# EAGLE design aery32_display_cloud (EAGLE 6.4)
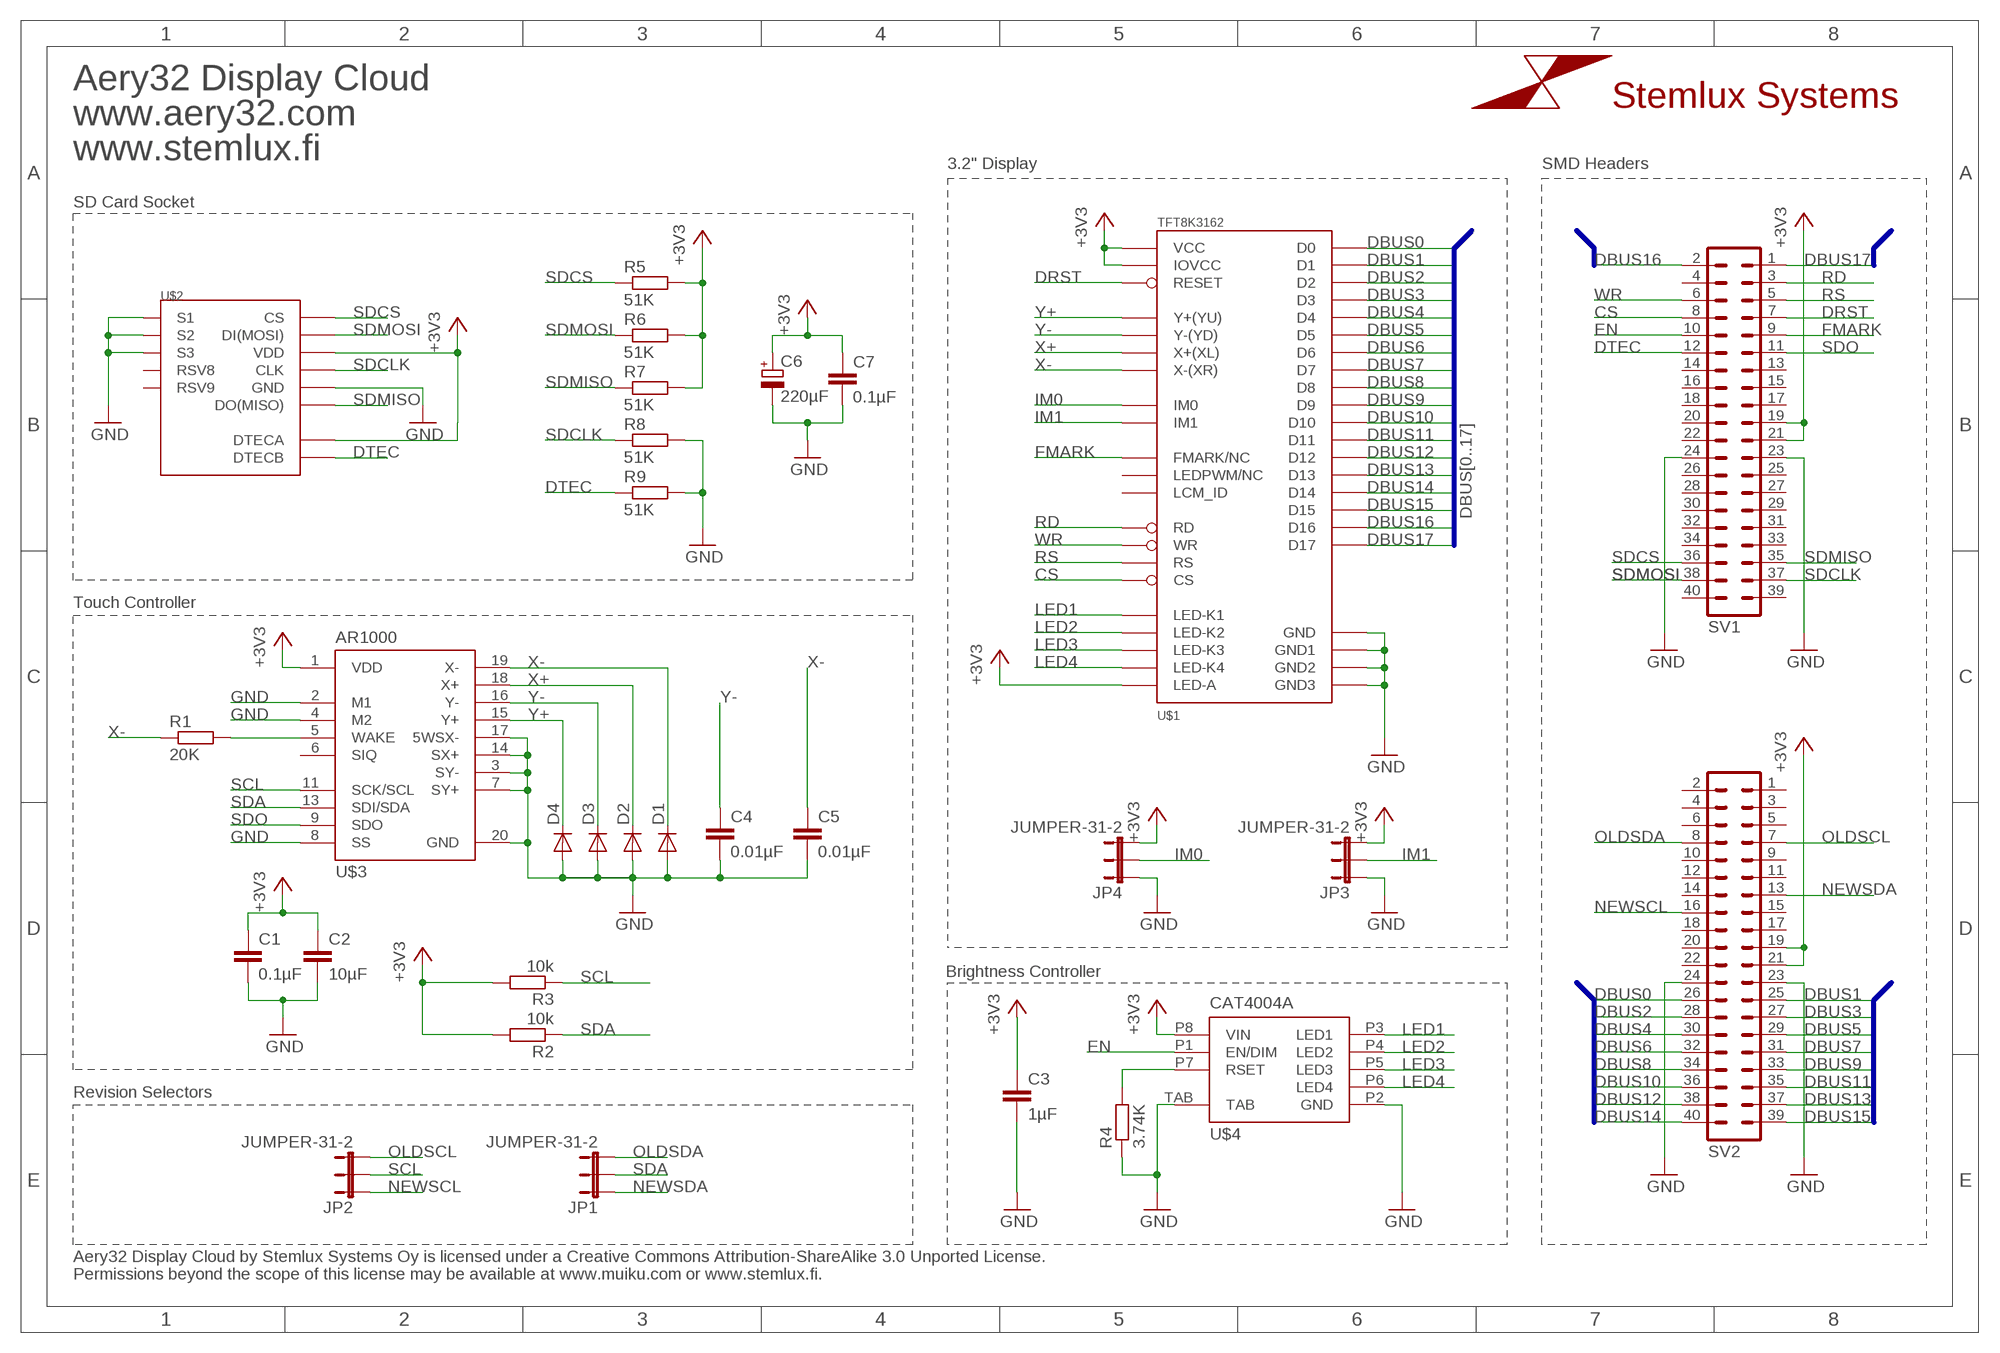
[diagram p0: schematic, sheet 1]

## Parts
C1  0.1µF  C-EUC0402  [C0402]
C2  10µF  C-EUC0805  [C0805]
C3  1µF  C-EUC0402  [C0402]
C4  0.01µF  C-EUC0402  [C0402]
C5  0.01µF  C-EUC0402  [C0402]
C6  220µF  CPOL-EUSMCB  [SMC_B]
C7  0.1µF  C-EUC0402  [C0402]
D1  DIODESOD  [SOD-323]
D2  DIODESOD  [SOD-323]
D3  DIODESOD  [SOD-323]
D4  DIODESOD  [SOD-323]
JP1  JUMPER-31-2  [SJ_3_PASTE1&2]
JP2  JUMPER-31-2  [SJ_3_PASTE1&2]
JP3  JUMPER-31-2  [SJ_3_PASTE1&2]
JP4  JUMPER-31-2  [SJ_3_PASTE1&2]
R1  20K  R-EU_R0402  [R0402]
R2  10k  R-EU_R0402  [R0402]
R3  10k  R-EU_R0402  [R0402]
R4  3.74K  R-EU_R0402  [R0402]
R5  51K  R-EU_R0402  [R0402]
R6  51K  R-EU_R0402  [R0402]
R7  51K  R-EU_R0402  [R0402]
R8  51K  R-EU_R0402  [R0402]
R9  51K  R-EU_R0402  [R0402]
SV1  MA20-2PEG  [MA20-2_SMD]
SV2  MA20-2PEG  [MA20-2_SMD]
U$1  TFT8K3162  [TFT8K3162]
U$2  MICROSD_SOCKETBT  [DM3BT_PUSH-PUSH_USD_SOCKET]
U$3  AR1000  [SSOP20]
U$4  CAT4004A  [UDFN-8,2X2]
U$7  LOGOSS  [LOGO_SILK_SMALL]

## Nets
+3V3: C1.1 C2.1 C3.1 C6.+ C7.1 JP3.3 JP4.3 R2.2 R3.2 R5.2 R6.2 R7.2 SV1.19 SV1.21 SV2.19 SV2.21 U$1.P$36(IOVCC) U$1.P$37(VCC) U$1.P$43(LED-A) U$2.#4(VDD)(VDD) U$2.DETECTA(DTECA) U$3.1(VDD) U$4.P8(VIN)
CS: SV1.8 U$1.P$34(CS)
DBUS0: SV2.26 U$1.P$30(D0)
DBUS1: SV2.25 U$1.P$29(D1)
DBUS2: SV2.28 U$1.P$28(D2)
DBUS3: SV2.27 U$1.P$27(D3)
DBUS4: SV2.30 U$1.P$26(D4)
DBUS5: SV2.29 U$1.P$25(D5)
DBUS6: SV2.32 U$1.P$24(D6)
DBUS7: SV2.31 U$1.P$23(D7)
DBUS8: SV2.34 U$1.P$22(D8)
DBUS9: SV2.33 U$1.P$21(D9)
DBUS10: SV2.36 U$1.P$20(D10)
DBUS11: SV2.35 U$1.P$19(D11)
DBUS12: SV2.38 U$1.P$18(D12)
DBUS13: SV2.37 U$1.P$17(D13)
DBUS14: SV2.40 U$1.P$16(D14)
DBUS15: SV2.39 U$1.P$15(D15)
DBUS16: SV1.2 U$1.P$14(D16)
DBUS17: SV1.1 U$1.P$13(D17)
DRST: SV1.7 U$1.P$12(RESET)
DTEC: R9.1 SV1.12 U$2.DETECTB(DTECB)
EN: SV1.10 U$4.P1(EN/DIM)
FMARK: SV1.9 U$1.P$9(FMARK/NC)
GND: C1.2 C2.2 C3.2 C4.2 C5.2 C6.- C7.2 D1.2(A) D2.2(A) D3.2(A) D4.2(A) JP3.1 JP4.1 R4.1 R8.2 R9.2 SV1.23 SV1.24 SV2.23 SV2.24 U$1.P$1(GND) U$1.P$6(GND1) U$1.P$35(GND2) U$1.P$44(GND3) U$2.#6(VSS)(GND) U$2.SHIELD1(S1) U$2.SHIELD2(S2) U$2.SHIELD3(S3) U$3.2(M1) U$3.3(SY-) U$3.4(M2) U$3.7(SY+) U$3.8(SS) U$3.14(SX+) U$3.17(5WSX-) U$3.20(GND) U$4.P2(GND) U$4.TAB
IM0: JP4.2 U$1.P$7(IM0)
IM1: JP3.2 U$1.P$8(IM1)
LED1: U$1.P$42(LED-K1) U$4.P3(LED1)
LED2: U$1.P$41(LED-K2) U$4.P4(LED2)
LED3: U$1.P$40(LED-K3) U$4.P5(LED3)
LED4: U$1.P$39(LED-K4) U$4.P6(LED4)
N$2: R4.2 U$4.P7(RSET)
N$4: R1.2 U$3.5(WAKE)
NEWSCL: JP2.1 SV2.16
NEWSDA: JP1.1 SV2.13
OLDSCL: JP2.3 SV2.7
OLDSDA: JP1.3 SV2.8
RD: SV1.3 U$1.P$31(RD)
RS: SV1.5 U$1.P$33(RS)
SCL: JP2.2 R3.1 U$3.11(SCK/SCL)
SDA: JP1.2 R2.1 U$3.13(SDI/SDA)
SDCLK: R8.1 SV1.37 U$2.#5(CLK)(CLK)
SDCS: R5.1 SV1.36 U$2.#1(DAT3_OR_CS)(CS)
SDMISO: R7.1 SV1.35 U$2.#7(DAT0_OR_DO)(DO(MISO))
SDMOSI: R6.1 SV1.38 U$2.2#(CMD_OR_DI)(DI(MOSI))
SDO: SV1.11 U$3.9(SDO)
WR: SV1.6 U$1.P$32(WR)
X+: D2.1(C) U$1.P$3(X+(XL)) U$3.18(X+)
X-: C5.1 D1.1(C) R1.1 U$1.P$5(X-(XR)) U$3.19(X-)
Y+: D4.1(C) U$1.P$2(Y+(YU)) U$3.15(Y+)
Y-: C4.1 D3.1(C) U$1.P$4(Y-(YD)) U$3.16(Y-)
Unconnected: SV1.4 SV1.13 SV1.14 SV1.15 SV1.16 SV1.17 SV1.18 SV1.20 SV1.22 SV1.25 SV1.26 SV1.27 SV1.28 SV1.29 SV1.30 SV1.31 SV1.32 SV1.33 SV1.34 SV1.39 SV1.40 SV2.1 SV2.2 SV2.3 SV2.4 SV2.5 SV2.6 SV2.9 SV2.10 SV2.11 SV2.12 SV2.14 SV2.15 SV2.17 SV2.18 SV2.20 SV2.22 U$1.P$10(LEDPWM/NC) U$1.P$11(LCM_ID) U$2.#8(DAT1_OR_NC)(RSV8) U$2.#9(DAT2_OR_NC)(RSV9) U$3.6(SIQ)

## Buses
DBUS[0..17]
DBUS[0..16]
DBUS[0..15]
DBUS[17]
DBUS[16]

## Notes on the sheet
- Aery32 Display Cloud
- www.aery32.com
- www.stemlux.fi
- 3.2" Display | SMD Headers
- SD Card Socket
- Touch Controller
- Brightness Controller
- Revision Selectors
- Aery32 Display Cloud by Stemlux Systems Oy is licensed under a Creative Commons Attribution-ShareAlike 3.0 Unported License.
- Permissions beyond the scope of this license may be available at www.muiku.com or www.stemlux.fi.

## Library data of the parts
C1-C5 C7 = resistor:C-EU: CAPACITOR, European symbol
C6 = resistor:CPOL-EU: POLARIZED CAPACITOR, European symbol
D1-D4 = SparkFun-DiscreteSemi:DIODE: Diode These are standard reverse protection diodes and small signal diodes. SMA package can handle up to about 1A. SOD-323 can handle about 200mA. What the SOD-323 package when ordering, there are some mfgs out there that are 5-pin packages.
JP1-JP4 = SparkFun-Passives:JUMPER-3
R1-R9 = resistor:R-EU_: RESISTOR, European symbol
SV1 SV2 = aery32:MA20-2: PIN HEADER
U$1 = Stemlux Systems:TFT8K3162
U$2 = Stemlux Systems:MICROSD_SOCKET
U$3 = Stemlux Systems:AR1000
U$4 = Stemlux Systems:CAT4004A
U$7 = Stemlux Systems:LOGO

## Board
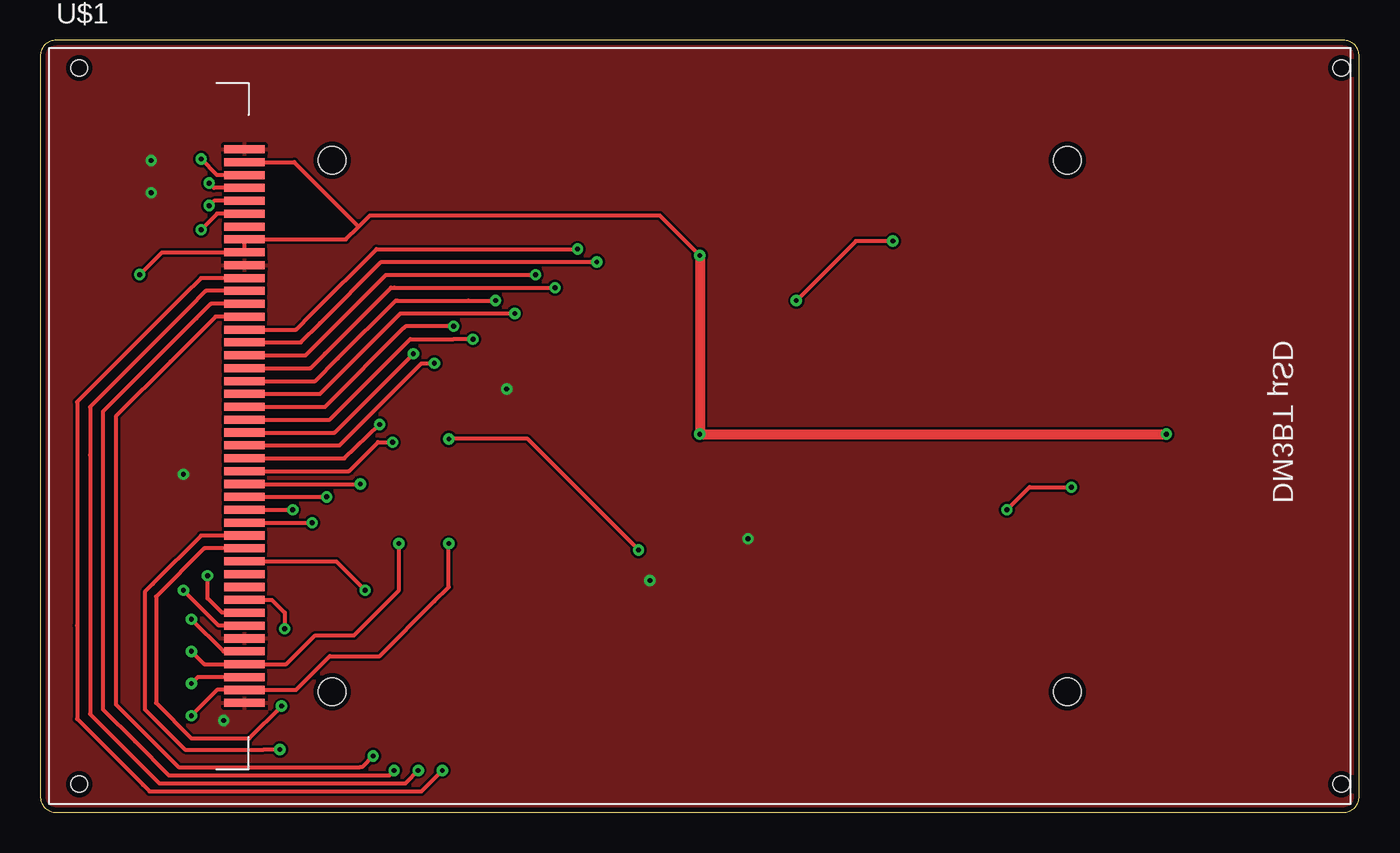
[diagram p1: board, top side]
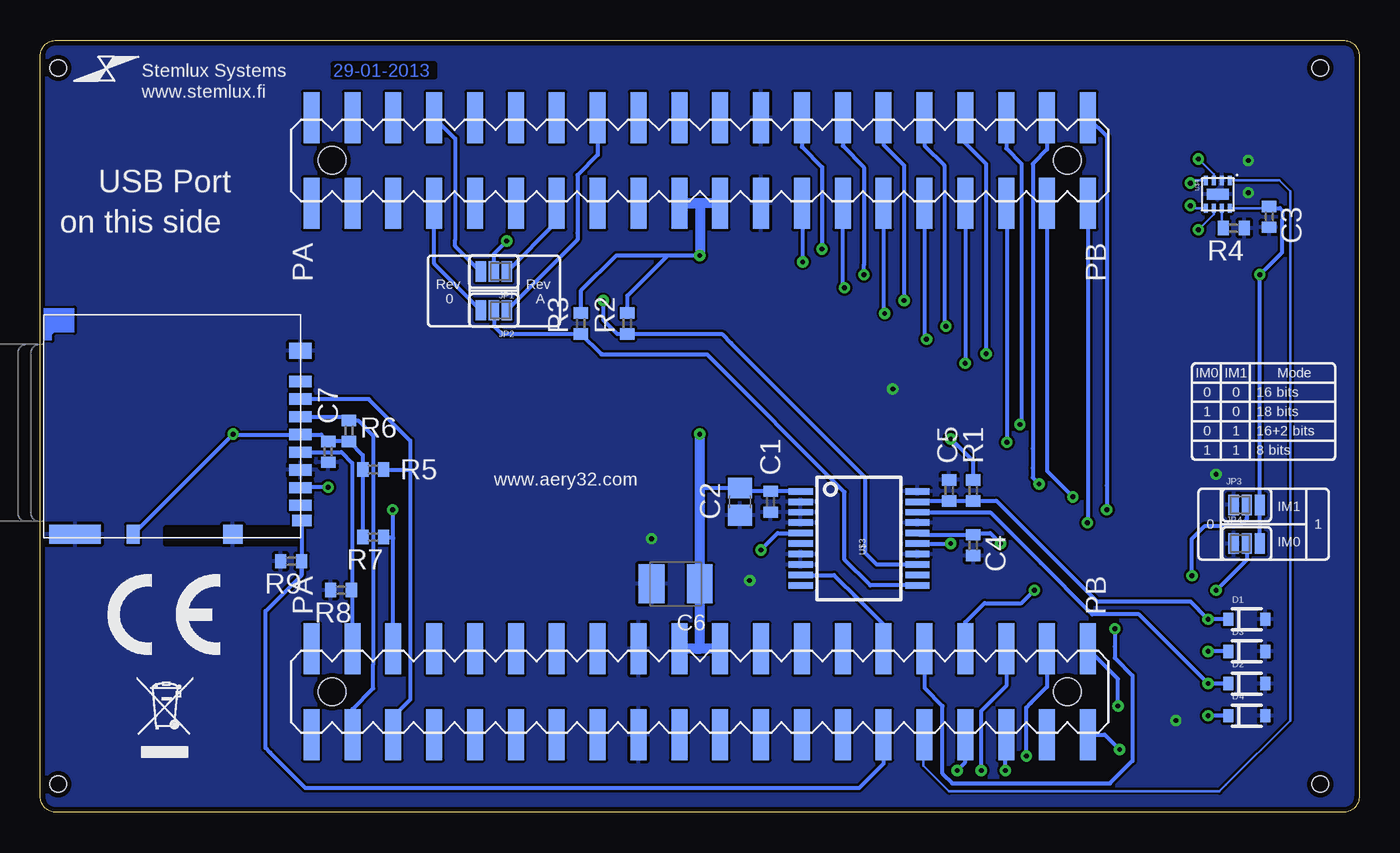
[diagram p2: board, bottom side, seen from below]

Size 82 x 47.98 mm. Coordinates in mm from the lower left corner, seen from the top.
Outline: 0,46.98 0,1 arc90 1,0 81,0 arc90 82,1 82,46.98 arc90 81,47.98 1,47.98 arc90 0,46.98
Copper layers (1*16): Top 0.018mm / dielectric 1.55mm / Bottom 0.018mm
Design rules "default *": minimum track width 0.15mm, minimum drill 0.25mm, track to track 0.15mm, track to pad 0.15mm, pad to pad 0.15mm, via to via 0.15mm, smd to smd 0.15mm, copper to edge 0.3mm, drill to drill 0.3mm, minimum pad ring 0.2mm, minimum via ring 0.2mm, stop-mask expansion 0.5mm, vias tented up to drill 0.3mm, thermal gap 0.2mm

### Footprints (pad centres in the part's own frame; a part is rotated, then mirrored left to right if it is on the bottom)
C0402 = smd 0.7 x 0.9: 1 -0.65,0; 2 0.65,0
C0805 = smd 1.3 x 1.5: 1 -0.85,0; 2 0.85,0
SMC_B = smd 1.6 x 2.4: + -1.5,0; - 1.5,0
SOD-323 = smd 0.63 x 0.83: 1 -1.15,0; 2 1.15,0
SJ_3_PASTE1&2 = smd 0.635 x 1.27: 1 -0.813,0; 2 0,0; 3 0.813,0
R0402 = smd 0.7 x 0.9: 1 -0.65,0; 2 0.65,0
MA20-2_SMD = smd 1 x 3.17: 1 -24.13,-2.665; 2 -24.13,2.665; 3 -21.59,-2.665; 4 -21.59,2.665; 5 -19.05,-2.665; 6 -19.05,2.665; 7 -16.51,-2.665; 8 -16.51,2.665; 9 -13.97,-2.665; 10 -13.97,2.665; 11 -11.43,-2.665; 12 -11.43,2.665; 13 -8.89,-2.665; 14 -8.89,2.665; 15 -6.35,-2.665; 16 -6.35,2.665; 17 -3.81,-2.665; 18 -3.81,2.665; 19 -1.27,-2.665; 20 -1.27,2.665; 21 1.27,-2.665; 22 1.27,2.665; 23 3.81,-2.665; 24 3.81,2.665; 25 6.35,-2.665; 26 6.35,2.665; 27 8.89,-2.665; 28 8.89,2.665; 29 11.43,-2.665; 30 11.43,2.665; 31 13.97,-2.665; 32 13.97,2.665; 33 16.51,-2.665; 34 16.51,2.665; 35 19.05,-2.665; 36 19.05,2.665; 37 21.59,-2.665; 38 21.59,2.665; 39 24.13,-2.665; 40 24.13,2.665 | hole 1.7: -22.86,0; 22.86,0
TFT8K3162 = smd 2.5 x 0.5 bottom: P$1 28.3,-17.2; P$2 28.3,-16.4; P$3 28.3,-15.6; P$4 28.3,-14.8; P$5 28.3,-14; P$6 28.3,-13.2; P$7 28.3,-12.4; P$8 28.3,-11.6; P$9 28.3,-10.8; P$10 28.3,-10; P$11 28.3,-9.2; P$12 28.3,-8.4; P$13 28.3,-7.6; P$14 28.3,-6.8; P$15 28.3,-6; P$16 28.3,-5.2; P$17 28.3,-4.4; P$18 28.3,-3.6; P$19 28.3,-2.8; P$20 28.3,-2; P$21 28.3,-1.2; P$22 28.3,-0.4; P$23 28.3,0.4; P$24 28.3,1.2; P$25 28.3,2; P$26 28.3,2.8; P$27 28.3,3.6; P$28 28.3,4.4; P$29 28.3,5.2; P$30 28.3,6; P$31 28.3,6.8; P$32 28.3,7.6; P$33 28.3,8.4; P$34 28.3,9.2; P$35 28.3,10; P$36 28.3,10.8; P$37 28.3,11.6; P$38 28.3,12.4; P$39 28.3,13.2; P$40 28.3,14; P$41 28.3,14.8; P$42 28.3,15.6; P$43 28.3,16.4; P$44 28.3,17.2 | hole 1: -39.875,-22.25; -39.875,22.25; 38.575,-22.25; 38.575,22.25
DM3BT_PUSH-PUSH_USD_SOCKET = smd 0.7 x 1.4: 2#(CMD_OR_DI) -0.575,7.975; #1(DAT3_OR_CS) -1.675,7.975; #4(VDD) 0.525,7.975; #5(CLK) 1.625,7.975; #6(VSS) 2.725,7.975; #7(DAT0_OR_DO) 3.825,7.975; #8(DAT1_OR_NC) 4.925,7.975; #9(DAT2_OR_NC) -2.775,7.975 | smd 1.2 x 0.8: DETECTA 6.725,-2.425 | smd 0.7 x 1.2: DETECTB 5.875,8.075 | smd 1 x 1.4: SHIELD1 -4.675,7.975 | smd 1.2 x 1.2: SHIELD2 6.725,3.775 | smd 1.2 x 3.2: SHIELD3 6.725,-6.025
SSOP20 = smd 0.4 x 1.5: 1 -2.925,-3.625; 2 -2.275,-3.625; 3 -1.625,-3.625; 4 -0.975,-3.625; 5 -0.325,-3.625; 6 0.325,-3.625; 7 0.975,-3.625; 8 1.625,-3.625; 9 2.275,-3.625; 10 2.925,-3.625; 11 2.925,3.625; 12 2.275,3.625; 13 1.625,3.625; 14 0.975,3.625; 15 0.325,3.625; 16 -0.325,3.625; 17 -0.975,3.625; 18 -1.625,3.625; 19 -2.275,3.625; 20 -2.925,3.625
UDFN-8,2X2 = smd 0.575 x 0.25: P1 -0.863,0.75; P2 -0.863,0.25; P3 -0.863,-0.25; P4 -0.863,-0.75; P5 0.863,-0.75; P6 0.863,-0.25; P7 0.863,0.25; P8 0.863,0.75 | smd 0.7 x 1.35: TAB 0,0

### Placement (x,y rotation side)
C1  36.6,19.3 270 bottom
C2  38.5,19.3 270 bottom
C3  5.6,37 270 bottom
C4  24,16.6 270 bottom
C5  25.5,20 90 bottom
C6  42.5,14.2 180 bottom
C7  64.1,22.4 270 bottom
D1  7,12 0 bottom
D2  7,8 0 bottom
D3  7,10 0 bottom
D4  7,6 0 bottom
JP1  53.8,33.6 180 bottom
JP2  53.8,31.2 180 bottom
JP3  7,19.1 0 bottom
JP4  7,16.7 0 bottom
R1  24,20 90 bottom
R2  45.5,30.38 90 bottom
R3  48.4,30.38 90 bottom
R4  7.8,36.3 180 bottom
R5  61.3,21.3 180 bottom
R6  62.8,23.7 270 bottom
R7  61.3,17.1 180 bottom
R8  63.3,13.8 180 bottom
R9  66.4,15.6 180 bottom
SV1  41,7.49 180 bottom
SV2  41,40.51 0 bottom
U$1  41,24 0 bottom
U$2  73.8,24 270 bottom
U$3  31.1,17.02 270 bottom
U$4  8.8,38.4 270 bottom
U$5  [CE/5MM]  77.8,9.8 0 bottom
U$6  [WEEE/5MM]  76,3.4 0 bottom
U$7  77.9,46.2 0 bottom

### Tracks (layer width: path | path; a pad name or v marks a point on that pad's centre or on a via)
+3V3  (via drill 0.3)
  Top 0.254: v6.19,33.41 7.57,34.8 9.5,34.8 U$1.P$36 U$1.P$37 16.4,35.6 19,35.6 19.8,36.4 | 19.8,36.4 20.5,37.1 38.5,37.1 v41,34.6 | U$1.P$43 15.8,40.4 19.8,36.4
  Top 0.61: v41,34.6 v41,23.5 v70,23.5
  Bottom 0.15: U$4.P8 5.71,37.54 C3.1
  Bottom 0.254: 61.95,21.5 61.95,22.2 R6.2 C7.1 64.53,23.48 U$2.#4(VDD) 70.03,23.48 v70,23.5 U$2.DETECTA | 61.95,21.5 R5.2 | R5.2 R7.2 | R5.2 61.95,21.5 | U$3.1 36.58,19.95 C1.1 38.28,19.95 C2.1 40.95,20.15 41,20.1 | v41,34.6 43,34.6 | 43,34.6 46.2,34.6 48.4,32.4 48.4,32.3 R3.2 | R2.2 45.5,32.1 43,34.6 | 5.75,37.55 C3.1 | JP4.3 JP3.3 v6.19,33.41 5.7,33.9 4.8,34.8 4.8,36.8 4.8,37.4 4.94,37.54 5.71,37.54
  Bottom 0.61: SV1.19 41.2,10.16 | 41.2,10.16 SV1.21 | SV2.21 SV2.19 41,37.85 v41,34.6 | C6.+ 41,10.16 41.2,10.16 | C6.+ 41,14.3 | 41,14.3 41,20.1 v41,23.5 | C6.+ 41,14.3
CS  (via drill 0.3)
  Top 0.254: U$1.P$34 10.4,33.2 10,33.2 8.9,32.1 2.3,25.5 2.3,11.6 2.3,5.8 6.4,1.7 6.8,1.3 19.9,1.3 23.7,1.3 v25,2.6
  Bottom 0.254: v25,2.6 24.49,3.11 SV1.8
DBUS0  (via drill 0.3)
  Top 0.254: U$1.P$30 15.9,30 16.9,31 20.9,35 v33.4,35
  Bottom 0.254: SV2.26 34.65,41.35 33.4,40.1 v33.4,35
DBUS1  (via drill 0.3)
  Top 0.254: v34.6,34.2 34.3,34.2 21.6,34.2 21.2,34.2 17.4,30.4 16.2,29.2 U$1.P$29
  Bottom 0.254: SV2.25 34.6,37.8 v34.6,34.2
DBUS2  (via drill 0.3)
  Top 0.254: v30.8,33.4 21.8,33.4 21.5,33.4 17.5,29.4 16.5,28.4 U$1.P$28
  Bottom 0.254: SV2.28 32.11,41.41 30.8,40.1 30.8,34 v30.8,33.4
DBUS3  (via drill 0.3)
  Top 0.254: v32,32.6 22,32.6 21.8,32.6 17.7,28.5 16.8,27.6 U$1.P$27
  Bottom 0.254: v32,32.6 32.11,32.71 SV2.27
DBUS4  (via drill 0.3)
  Top 0.254: v28.3,31.8 26.6,31.8 22.2,31.8 22.1,31.8 18.5,28.2 17.1,26.8 U$1.P$26
  Bottom 0.254: SV2.30 29.57,41.47 28.3,40.2 v28.3,31.8
DBUS5  (via drill 0.3)
  Top 0.254: U$1.P$25 17.4,26 22.4,31 28.8,31 v29.5,31
  Bottom 0.254: SV2.29 29.57,31.07 v29.5,31
DBUS6  (via drill 0.3)
  Top 0.254: U$1.P$24 17.7,25.2 22.6,30.1 22.7,30.2 v25.7,30.2
  Bottom 0.254: SV2.32 27.03,41.43 25.8,40.2 25.8,30.3 v25.7,30.2
DBUS7  (via drill 0.3)
  Top 0.254: U$1.P$23 18,24.4 22.9,29.3 23,29.4 25.7,29.4 v26.9,29.4
  Bottom 0.254: SV2.31 27.03,29.53 v26.9,29.4
DBUS8  (via drill 0.3)
  Top 0.254: U$1.P$22 18.3,23.6 v23.2,28.5
  Bottom 0.254: SV2.34 24.49,41.59 23.2,40.3 v23.2,28.5
DBUS9  (via drill 0.3)
  Top 0.254: U$1.P$21 18.6,22.8 23,27.2 23.7,27.9 v24.5,27.9
  Bottom 0.254: SV2.33 v24.49,27.91 v24.5,27.9
DBUS10  (via drill 0.3)
  Top 0.254: U$1.P$20 18.9,22 v21.1,24.1
  Bottom 0.254: SV2.36 21.95,41.25 21,40.3 21,24.2 v21.1,24.1
DBUS11  (via drill 0.3)
  Top 0.254: U$1.P$19 19.2,21.2 21,23 v21.9,23
  Bottom 0.254: SV2.35 21.9,37.8 v21.9,23
DBUS12  (via drill 0.3)
  Top 0.254: U$1.P$18 v19.9,20.4
  Bottom 0.254: SV2.38 19.41,41.19 20.3,40.3 20.3,22.6 20.3,21.4 20.3,20.8 v19.9,20.4
DBUS13  (via drill 0.3)
  Top 0.254: U$1.P$17 v17.8,19.6
  Bottom 0.254: SV2.37 19.41,21.79 19.41,21.21 v17.8,19.6
DBUS14  (via drill 0.3)
  Top 0.254: U$1.P$16 14.8,18.8 v15.7,18.8
  Bottom 0.254: SV2.40 15.7,42.01 15.7,20.3 v15.7,18.8
DBUS15  (via drill 0.3)
  Top 0.254: U$1.P$15 v16.9,18
  Bottom 0.254: SV2.39 16.87,18.03 v16.9,18
DBUS16  (via drill 0.3)
  Top 0.254: U$1.P$14 10,17.2 7,14.2 6.5,13.7 6.5,7.4 6.5,6.4 8.9,4 9,3.9 13.9,3.9 v14.9,3.9
  Bottom 0.254: SV1.2 15.82,4.83 v14.9,3.9
DBUS17  (via drill 0.3)
  Top 0.254: U$1.P$13 10.2,16.4 7.2,13.4 7.2,6.8 9.4,4.6 13,4.6 v15,6.6
  Bottom 0.254: v15,6.6 15,8.29 SV1.1
DRST  (via drill 0.3)
  Top 0.254: U$1.P$12 18.4,15.6 v20.2,13.8
  Bottom 0.254: SV1.7 24.49,11.81 23.3,13 21,13 v20.2,13.8
DTEC
  Bottom 0.254: SV1.12 29.57,3.03 31.1,1.5 65.5,1.5 67.7,3.7 68,4 68,12.5 65.72,14.78 | 65.72,14.78 U$2.DETECTB | 65.72,14.78 65.75,14.8 R9.1
EN
  Bottom 0.15: 27.1,4.76 27.1,2.9 25.5,1.3 8.7,1.3 8.3,1.7 4.3,5.7 4.3,38.6 4.96,39.27 U$4.P1
  Bottom 0.254: 27.1,4.76 SV1.10
FMARK  (via drill 0.3)
  Top 0.254: U$1.P$9 14.4,13.2 15.2,12.4 v15.2,11.4
  Bottom 0.254: v15.2,11.4 15.2,10.3 15.2,9.6 14.1,8.5 14.1,3.2 15.5,1.8 24.2,1.8 25.3,1.8 25.9,2.4 25.9,6.6 27.03,7.73 SV1.9
GND  (via drill 0.3)
  Bottom 0.254: 36.58,18.65 C1.2
  other vias: 44,17 6.9,40.5 6.9,38.5 29,26.3 37.9,14.4 11.4,5.7 8.9,21
  pour Top (isolate 0.15): 0,0 82,0 82,48 0,48
  pour Bottom (isolate 0.15): 0,0 0,48 82,48 82,0
IM0  (via drill 0.3)
  Top 0.254: U$1.P$7 11.4,11.6 11.1,11.6 v8.9,13.8
  Bottom 0.254: JP4.2 7,15.7 v8.9,13.8
IM1  (via drill 0.3)
  Top 0.254: U$1.P$8 11.3,12.4 10.4,13.3 v10.4,14.7
  Bottom 0.254: JP3.2 7,18.3 7,18.2 7.3,17.9 7.4,17.8 9.6,17.8 10.4,17 v10.4,14.7
LED1  (via drill 0.3)
  Top 0.254: U$1.P$42 11,39.6 v10,40.6
  Bottom 0.15: U$4.P3 9.05,39.65 v10,40.6
LED2  (via drill 0.3)
  Top 0.254: U$1.P$41 10.8,38.8 v10.5,39.1
  Bottom 0.15: U$4.P4 10.34,39.27 v10.5,39.1
LED3  (via drill 0.3)
  Top 0.254: U$1.P$40 10.8,38 v10.5,37.7
  Bottom 0.15: U$4.P5 10.34,37.54 v10.5,37.7
LED4  (via drill 0.3)
  Top 0.254: U$1.P$39 11,37.2 v10,36.2
  Bottom 0.15: U$4.P6 9.05,37.15 v10,36.2
N$2
  Bottom 0.15: U$4.P7 8.55,36.48 R4.2
N$4  (via drill 0.3)
  Top 0.254: v37.2,16.3 30.3,23.2 v25.4,23.2
  Bottom 0.254: R1.2 24,21.8 v25.4,23.2 | v37.2,16.3 36.16,17.35 U$3.5
NEWSCL
  Bottom 0.254: SV2.16 47.35,40.85 48.6,39.6 48.6,35.99 48.6,35.59 JP2.1
NEWSDA
  Bottom 0.254: SV2.13 49.89,37.1 49.89,36.7 JP1.1
OLDSCL
  Bottom 0.254: SV2.7 57.51,34.5 57.51,34.1 JP2.3
OLDSDA
  Bottom 0.254: SV2.8 56.2,41.87 56.2,36.2 56.2,35.59 56.2,35.19 JP1.3
RD  (via drill 0.3)
  Top 0.254: U$1.P$31 10.9,30.8 8.1,28 4.7,24.6 4.7,6.7 8.6,2.8 19.9,2.8 20,2.8 v20.7,3.5
  Bottom 0.254: SV1.3 19.41,7.79 20.4,6.8 20.7,6.5 v20.7,3.5
RS  (via drill 0.3)
  Top 0.254: U$1.P$33 10.3,32.4 9.2,31.3 3.1,25.2 3.1,22.2 3.1,6.1 6.1,3.1 7.4,1.8 22.7,1.8 v23.5,2.6
  Bottom 0.254: SV1.5 21.95,7.85 23.2,6.6 23.5,6.3 v23.5,2.6
SCL
  Bottom 0.254: U$3.11 30.39,14.1 32,15.7 32,19.9 40.55,28.45 47.02,28.45 47.12,28.45 R3.1 53.33,29.73 53.8,30.2 JP2.2
SDA  (via drill 0.3)
  Top 0.254: v53,35.5 52.1,35.5 50.7,35.5 v47,31.8
  Bottom 0.254: U$3.13 30,15.4 30.7,16.1 30.7,20.8 39.05,29.15 39.63,29.73 R2.1 46.13,29.73 46.3,29.9 47,30.6 v47,31.8 | JP1.2 53.8,34.7 v53,35.5
SDCLK
  Bottom 0.254: SV1.37 62.59,13.8 | 62.59,13.8 62.59,19.14 62.59,20.5 | 62.59,20.5 62.59,20.69 | U$2.#5(CLK) 63.27,22.38 62.6,21.7 62.6,20.51 62.59,20.5 | R8.1 62.59,13.8
SDCS
  Bottom 0.254: SV1.36 60.05,5.95 59,7 59,21.3 | 65.8,25.7 U$2.#1(DAT3_OR_CS) 61.58,25.68 61.55,25.65 59,23.1 59,21.3 | R5.1 59,21.3
SDMISO  (via drill 0.3)
  Top 0.254: v60.1,18.8 61.5,20.2 v64.1,20.2
  Bottom 0.254: SV1.35 60.05,17 | 60.05,17 60.05,17.05 60.05,18.75 v60.1,18.8 | 65.65,20 U$2.#7(DAT0_OR_DO) 65.8,20.2 v64.1,20.2 | R7.1 60.15,17.1 60.05,17
SDMOSI
  Bottom 0.254: SV1.38 62.59,6.41 61.3,7.7 61.3,9.2 61.3,23.4 62.25,24.35 R6.1 63.02,24.58 U$2.2#(CMD_OR_DI)
SDO
  Bottom 0.254: SV1.11 29.57,11.67 31.1,13.2 | 31.1,13.2 31.4,13.5 | U$3.9 32.65,14.75 31.1,13.2
WR  (via drill 0.3)
  Top 0.254: U$1.P$32 10.6,31.6 9.7,30.7 3.9,24.9 3.9,22.3 3.9,6.4 5.9,4.4 8,2.3 21.2,2.3 21.7,2.3 v22,2.6
  Bottom 0.254: 22.2,4.58 SV1.6 22,4.78 v22,2.6
X+  (via drill 0.3)
  Top 0.254: U$1.P$3 9.8,8.4 v9.4,8
  Bottom 0.254: U$3.18 22.95,18.65 19.8,15.5 16.8,12.5 16.6,12.3 13.7,12.3 v9.4,8 D2.1
X-  (via drill 0.3)
  Top 0.254: U$1.P$5 11.4,10 v9.4,12
  Bottom 0.254: U$3.19 27.4,19.37 25.52,19.37 C5.1 R1.1 22.59,19.35 22.55,19.35 18.1,14.9 16.3,13.1 10.5,13.1 9.5,12.1 v9.4,12 D1.1
Y+  (via drill 0.3)
  Top 0.254: v9.4,6 11,7.6 U$1.P$2 15.7,7.6 15.9,7.6 18,9.7 21.1,9.7 24.5,13.1 25.4,14 v25.4,16.7
  Bottom 0.254: U$3.15 v25.41,16.7 v25.4,16.7 | D4.1 v9.4,6
Y-  (via drill 0.3)
  Top 0.254: v22.3,16.7 22.3,13.8 19.5,11 17.1,11 15.3,9.2 U$1.P$4 10.2,9.2 v9.4,10
  Bottom 0.254: D3.1 v9.4,10 | U$3.16 27.38,17.25 C4.1 23.68,17.35 22.95,17.35 v22.3,16.7

### Text on the board
Bottom: 29-01-2013
_bsilk: Stemlux Systems | www.stemlux.fi | USB Port | on this side | PB | PA | A | Rev | 0 | Rev | Mode | IM1 | IM0 | 16 bits | 0 | 0 | 18 bits | 0 | 1 | 16+2 bits | 1 | 0 | 8 bits | 1 | 1 | www.aery32.com | IM1 | 1 | 0 | IM0 | PB | PA